# Altium schematic sheet TopView.SchDoc
size A3
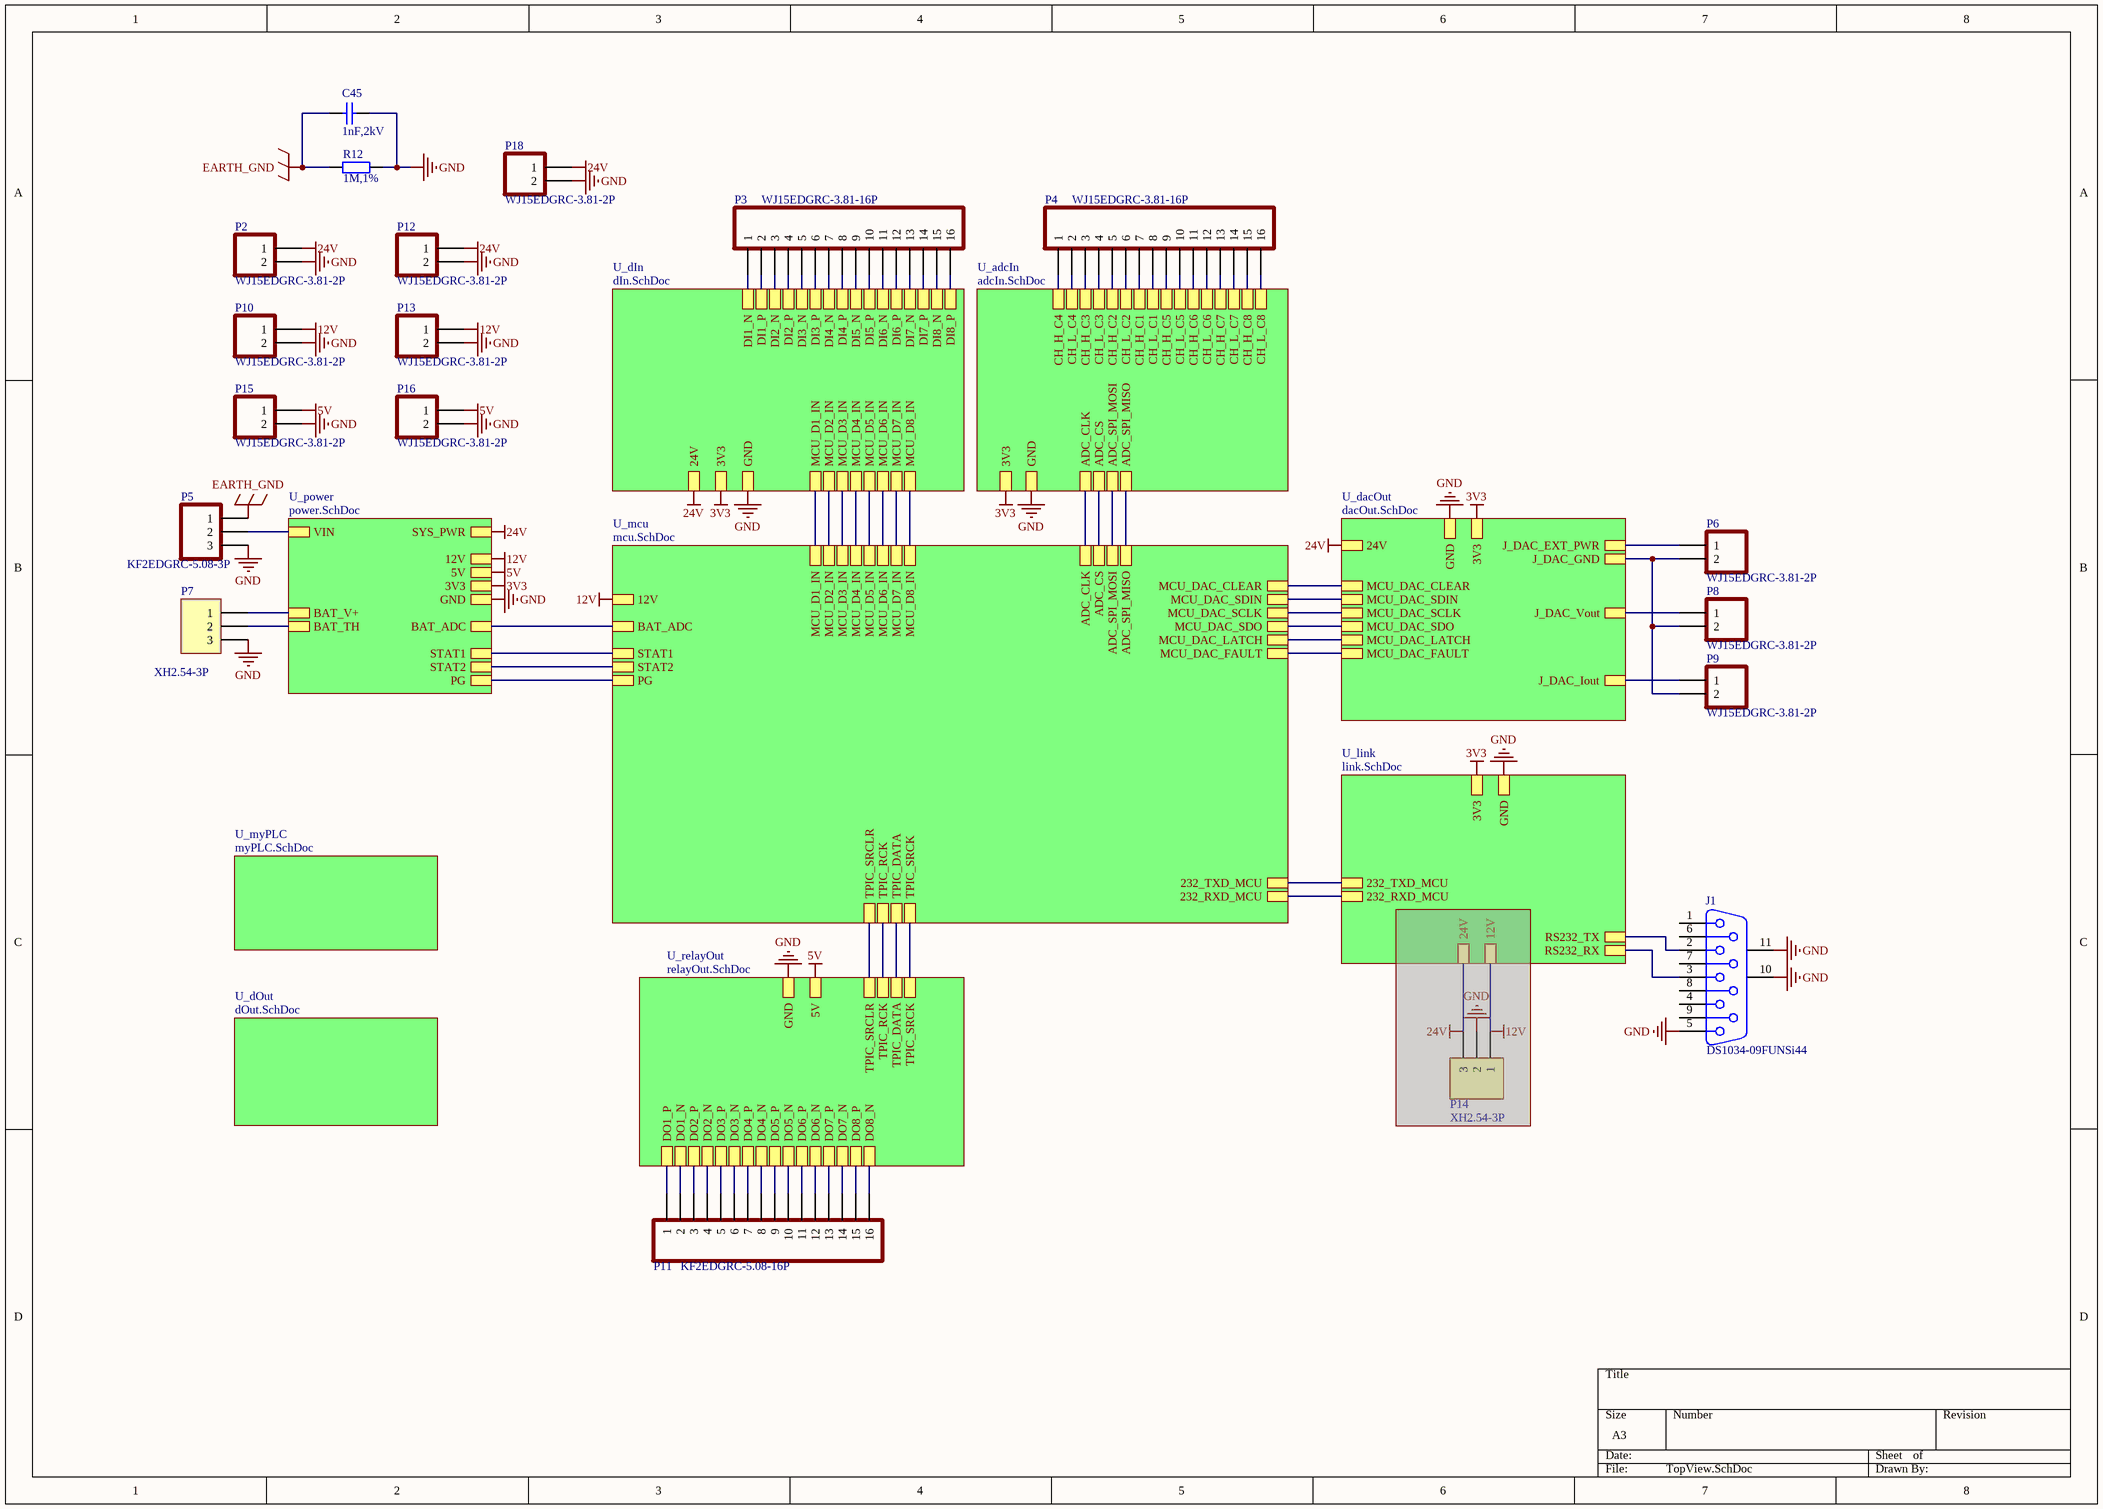
[diagram p0: TopView.SchDoc]

## Parts
C45  1nF,2kV  [C1206]
J1  DS1034-09FUNSi44  [DSUB-TH_2-5747706-0]
P2  WJ15EDGRC-3.81-2P  [CONN-TH_2P-P3.81_WJ15EDGRC-3.81-2P]
P3  WJ15EDGRC-3.81-16P  [CONN-TH_16P-P3.81_WJ15EDGRC-3.81-16P]
P4  WJ15EDGRC-3.81-16P  [CONN-TH_16P-P3.81_WJ15EDGRC-3.81-16P]
P5  KF2EDGRC-5.08-3P  [CONN-TH_3P-P5.08_KF2EDGRC-5.08-3P]
P6  WJ15EDGRC-3.81-2P  [CONN-TH_2P-P3.81_WJ15EDGRC-3.81-2P]
P7  XH2.54-3P  [XH2.54-3P;弯角;]
P8  WJ15EDGRC-3.81-2P  [CONN-TH_2P-P3.81_WJ15EDGRC-3.81-2P]
P9  WJ15EDGRC-3.81-2P  [CONN-TH_2P-P3.81_WJ15EDGRC-3.81-2P]
P10  WJ15EDGRC-3.81-2P  [CONN-TH_2P-P3.81_WJ15EDGRC-3.81-2P]
P11  KF2EDGRC-5.08-16P  [CONN-TH_16P-P5.08_KF2EDGRC-5.08-16P]
P12  WJ15EDGRC-3.81-2P  [CONN-TH_2P-P3.81_WJ15EDGRC-3.81-2P]
P13  WJ15EDGRC-3.81-2P  [CONN-TH_2P-P3.81_WJ15EDGRC-3.81-2P]
P14  XH2.54-3P  [XH2.54-3P-直角]  (masked out: inside a compile mask, not in the netlist)
P15  WJ15EDGRC-3.81-2P  [CONN-TH_2P-P3.81_WJ15EDGRC-3.81-2P]
P16  WJ15EDGRC-3.81-2P  [CONN-TH_2P-P3.81_WJ15EDGRC-3.81-2P]
P18  WJ15EDGRC-3.81-2P  [CONN-TH_2P-P3.81_WJ15EDGRC-3.81-2P]
R12  1M,1%  [R1206]

## Sub-sheets
U_adcIn = adcIn.SchDoc: ADC_SPI_MISO, ADC_SPI_MOSI, ADC_CS, ADC_CLK, 3V3, GND, CH_L_C8, CH_L_C3, CH_L_C1, CH_H_C7, CH_H_C2, CH_H_C3, CH_L_C4, CH_L_C6, CH_L_C7, CH_L_C5, CH_H_C4, CH_H_C1, CH_H_C5, CH_H_C8, CH_L_C2, CH_H_C6
U_dacOut = dacOut.SchDoc: 24V, MCU_DAC_CLEAR, MCU_DAC_SDIN, MCU_DAC_SCLK, 3V3, J_DAC_Iout, J_DAC_Vout, MCU_DAC_SDO, J_DAC_GND, MCU_DAC_FAULT, J_DAC_EXT_PWR, MCU_DAC_LATCH, GND
U_dIn = dIn.SchDoc: MCU_D1_IN, MCU_D2_IN, MCU_D3_IN, MCU_D4_IN, MCU_D5_IN, MCU_D6_IN, MCU_D7_IN, MCU_D8_IN, GND, 24V, 3V3, DI1_N, DI1_P, DI2_N, DI2_P, DI3_N, DI3_P, DI4_N, DI4_P, DI5_N, DI5_P, DI6_N, DI6_P, DI7_N, DI7_P, DI8_N, DI8_P
U_dOut = dOut.SchDoc: no entries
U_link = link.SchDoc: GND, RS232_TX, RS232_RX, 232_TXD_MCU, 232_RXD_MCU, 3V3, 24V, 12V
U_mcu = mcu.SchDoc: ADC_SPI_MISO, ADC_SPI_MOSI, ADC_CS, ADC_CLK, MCU_D1_IN, MCU_D2_IN, MCU_D3_IN, MCU_D4_IN, MCU_D5_IN, MCU_D6_IN, MCU_D7_IN, MCU_D8_IN, TPIC_SRCLR, TPIC_RCK, TPIC_DATA, TPIC_SRCK, 232_TXD_MCU, 232_RXD_MCU, MCU_DAC_CLEAR, MCU_DAC_SDIN, MCU_DAC_SCLK, MCU_DAC_SDO, MCU_DAC_FAULT, MCU_DAC_LATCH, 12V, BAT_ADC, STAT1, STAT2, PG
U_myPLC = myPLC.SchDoc: no entries
U_power = power.SchDoc: GND, 12V, 5V, 3V3, VIN, BAT_V+, BAT_TH, BAT_ADC, SYS_PWR, STAT1, STAT2, PG
U_relayOut = relayOut.SchDoc: DO1_P, DO2_P, DO3_P, DO4_P, DO5_P, DO6_P, DO7_P, DO8_P, DO1_N, DO2_N, DO3_N, DO4_N, DO5_N, DO6_N, DO7_N, DO8_N, GND, 5V, TPIC_SRCLR, TPIC_RCK, TPIC_DATA, TPIC_SRCK

## Nets
3V3: sheet U_adcIn/3V3, sheet U_dacOut/3V3, sheet U_dIn/3V3, sheet U_link/3V3, sheet U_power/3V3
5V: P15.1 P16.1 ; sheet U_relayOut/5V, sheet U_power/5V
12V: P10.1 P13.1 ; sheet U_mcu/12V, sheet U_power/12V
24V: P2.1 P12.1 P18.1 ; sheet U_dacOut/24V, sheet U_dIn/24V, sheet U_power/SYS_PWR
EARTH_GND: C45.1 P5.1 R12.2
GND: C45.2 J1.5 J1.10(MH1) J1.11(MH2) P2.2 P5.3 P7.3 P10.2 P12.2 P13.2 P15.2 P16.2 P18.2 R12.1 ; sheet U_adcIn/GND, sheet U_dacOut/GND, sheet U_dIn/GND, sheet U_link/GND, sheet U_relayOut/GND, sheet U_power/GND
NetJ1_2: J1.2 ; sheet U_link/RS232_TX
NetJ1_3: J1.3 ; sheet U_link/RS232_RX
NetP3_1: P3.1 ; sheet U_dIn/DI1_N
NetP3_2: P3.2 ; sheet U_dIn/DI1_P
NetP3_3: P3.3 ; sheet U_dIn/DI2_N
NetP3_4: P3.4 ; sheet U_dIn/DI2_P
NetP3_5: P3.5 ; sheet U_dIn/DI3_N
NetP3_6: P3.6 ; sheet U_dIn/DI3_P
NetP3_7: P3.7 ; sheet U_dIn/DI4_N
NetP3_8: P3.8 ; sheet U_dIn/DI4_P
NetP3_9: P3.9 ; sheet U_dIn/DI5_N
NetP3_10: P3.10 ; sheet U_dIn/DI5_P
NetP3_11: P3.11 ; sheet U_dIn/DI6_N
NetP3_12: P3.12 ; sheet U_dIn/DI6_P
NetP3_13: P3.13 ; sheet U_dIn/DI7_N
NetP3_14: P3.14 ; sheet U_dIn/DI7_P
NetP3_15: P3.15 ; sheet U_dIn/DI8_N
NetP3_16: P3.16 ; sheet U_dIn/DI8_P
NetP4_1: P4.1 ; sheet U_adcIn/CH_H_C4
NetP4_2: P4.2 ; sheet U_adcIn/CH_L_C4
NetP4_3: P4.3 ; sheet U_adcIn/CH_H_C3
NetP4_4: P4.4 ; sheet U_adcIn/CH_L_C3
NetP4_5: P4.5 ; sheet U_adcIn/CH_H_C2
NetP4_6: P4.6 ; sheet U_adcIn/CH_L_C2
NetP4_7: P4.7 ; sheet U_adcIn/CH_H_C1
NetP4_8: P4.8 ; sheet U_adcIn/CH_L_C1
NetP4_9: P4.9 ; sheet U_adcIn/CH_H_C5
NetP4_10: P4.10 ; sheet U_adcIn/CH_L_C5
NetP4_11: P4.11 ; sheet U_adcIn/CH_H_C6
NetP4_12: P4.12 ; sheet U_adcIn/CH_L_C6
NetP4_13: P4.13 ; sheet U_adcIn/CH_H_C7
NetP4_14: P4.14 ; sheet U_adcIn/CH_L_C7
NetP4_15: P4.15 ; sheet U_adcIn/CH_H_C8
NetP4_16: P4.16 ; sheet U_adcIn/CH_L_C8
NetP5_2: P5.2 ; sheet U_power/VIN
NetP6_1: P6.1 ; sheet U_dacOut/J_DAC_EXT_PWR
NetP6_2: P6.2 P8.2 P9.2 ; sheet U_dacOut/J_DAC_GND
NetP7_1: P7.1 ; sheet U_power/BAT_V+
NetP7_2: P7.2 ; sheet U_power/BAT_TH
NetP8_1: P8.1 ; sheet U_dacOut/J_DAC_Vout
NetP9_1: P9.1 ; sheet U_dacOut/J_DAC_Iout
NetP11_1: P11.1 ; sheet U_relayOut/DO1_P
NetP11_2: P11.2 ; sheet U_relayOut/DO1_N
NetP11_3: P11.3 ; sheet U_relayOut/DO2_P
NetP11_4: P11.4 ; sheet U_relayOut/DO2_N
NetP11_5: P11.5 ; sheet U_relayOut/DO3_P
NetP11_6: P11.6 ; sheet U_relayOut/DO3_N
NetP11_7: P11.7 ; sheet U_relayOut/DO4_P
NetP11_8: P11.8 ; sheet U_relayOut/DO4_N
NetP11_9: P11.9 ; sheet U_relayOut/DO5_P
NetP11_10: P11.10 ; sheet U_relayOut/DO5_N
NetP11_11: P11.11 ; sheet U_relayOut/DO6_P
NetP11_12: P11.12 ; sheet U_relayOut/DO6_N
NetP11_13: P11.13 ; sheet U_relayOut/DO7_P
NetP11_14: P11.14 ; sheet U_relayOut/DO7_N
NetP11_15: P11.15 ; sheet U_relayOut/DO8_P
NetP11_16: P11.16 ; sheet U_relayOut/DO8_N
(unnamed): sheet U_adcIn/ADC_SPI_MISO, sheet U_mcu/ADC_SPI_MISO
(unnamed): sheet U_adcIn/ADC_SPI_MOSI, sheet U_mcu/ADC_SPI_MOSI
(unnamed): sheet U_adcIn/ADC_CS, sheet U_mcu/ADC_CS
(unnamed): sheet U_adcIn/ADC_CLK, sheet U_mcu/ADC_CLK
(unnamed): sheet U_dacOut/MCU_DAC_CLEAR, sheet U_mcu/MCU_DAC_CLEAR
(unnamed): sheet U_dacOut/MCU_DAC_SDIN, sheet U_mcu/MCU_DAC_SDIN
(unnamed): sheet U_dacOut/MCU_DAC_SCLK, sheet U_mcu/MCU_DAC_SCLK
(unnamed): sheet U_dacOut/MCU_DAC_SDO, sheet U_mcu/MCU_DAC_SDO
(unnamed): sheet U_dacOut/MCU_DAC_FAULT, sheet U_mcu/MCU_DAC_FAULT
(unnamed): sheet U_dacOut/MCU_DAC_LATCH, sheet U_mcu/MCU_DAC_LATCH
(unnamed): sheet U_dIn/MCU_D1_IN, sheet U_mcu/MCU_D1_IN
(unnamed): sheet U_dIn/MCU_D2_IN, sheet U_mcu/MCU_D2_IN
(unnamed): sheet U_dIn/MCU_D3_IN, sheet U_mcu/MCU_D3_IN
(unnamed): sheet U_dIn/MCU_D4_IN, sheet U_mcu/MCU_D4_IN
(unnamed): sheet U_dIn/MCU_D5_IN, sheet U_mcu/MCU_D5_IN
(unnamed): sheet U_dIn/MCU_D6_IN, sheet U_mcu/MCU_D6_IN
(unnamed): sheet U_dIn/MCU_D7_IN, sheet U_mcu/MCU_D7_IN
(unnamed): sheet U_dIn/MCU_D8_IN, sheet U_mcu/MCU_D8_IN
(unnamed): sheet U_link/232_TXD_MCU, sheet U_mcu/232_TXD_MCU
(unnamed): sheet U_link/232_RXD_MCU, sheet U_mcu/232_RXD_MCU
(unnamed): sheet U_mcu/TPIC_SRCLR, sheet U_relayOut/TPIC_SRCLR
(unnamed): sheet U_mcu/TPIC_RCK, sheet U_relayOut/TPIC_RCK
(unnamed): sheet U_mcu/TPIC_DATA, sheet U_relayOut/TPIC_DATA
(unnamed): sheet U_mcu/TPIC_SRCK, sheet U_relayOut/TPIC_SRCK
(unnamed): sheet U_mcu/BAT_ADC, sheet U_power/BAT_ADC
(unnamed): sheet U_mcu/STAT1, sheet U_power/STAT1
(unnamed): sheet U_mcu/STAT2, sheet U_power/STAT2
(unnamed): sheet U_mcu/PG, sheet U_power/PG

Not connected (* = marked no-connect by the designer): J1 1 4 6 7 8 9

## Library data of the parts
C45 = 无极电容: Value: 104, 16V; Type: 贴片电容
J1 = D Connector 9: Receptacle Assembly, 9 Position, Right Angle; PackageDocument: O; Positions: 9; Published: 15-Jun-2001; LatestRevisionDate: 17-Jul-2002; LatestRevisionNote: Re-released for DXP Platform.; DatasheetDocument: 1-Sep-1999; PackageReference: 788750; Publisher: Altium Limited; Orientation: Right Angle; Gender: Receptacle
P5 = WJ15EDGRC-3.81-3P: LatestRevisionNote: Re-released for DXP Platform.
P7 = Header 3: Header, 3-Pin; LatestRevisionDate: 17-Jul-2002; LatestRevisionNote: Re-released for DXP Platform.; Publisher: Altium Limited
P11 = WJ15EDGRC-3.81-16P: LatestRevisionNote: Re-released for DXP Platform.
P14 = C3-3Pin: C3连接器插座, 3-Pin; name: C3连接器
R12 = 电阻: Value: 3.3K, 10%; Type: 贴片电阻
P2 P6 P8-P10 P12 P13 P15 P16 P18 = WJ15EDGRC-3.81-2P: LatestRevisionNote: Re-released for DXP Platform.
P3 P4 = WJ15EDGRC-3.81-16P: LatestRevisionNote: Re-released for DXP Platform.